# EasyEDA schematic 5G-PreCiSe-SMT100_2023-10-27.json
TITLE: SMT100-LoRa-v0.9; REV: 0.9; Date: 2023-01-26; Sheet: 1/1; Company: 5G-PreCiSe / HS Reutlingen
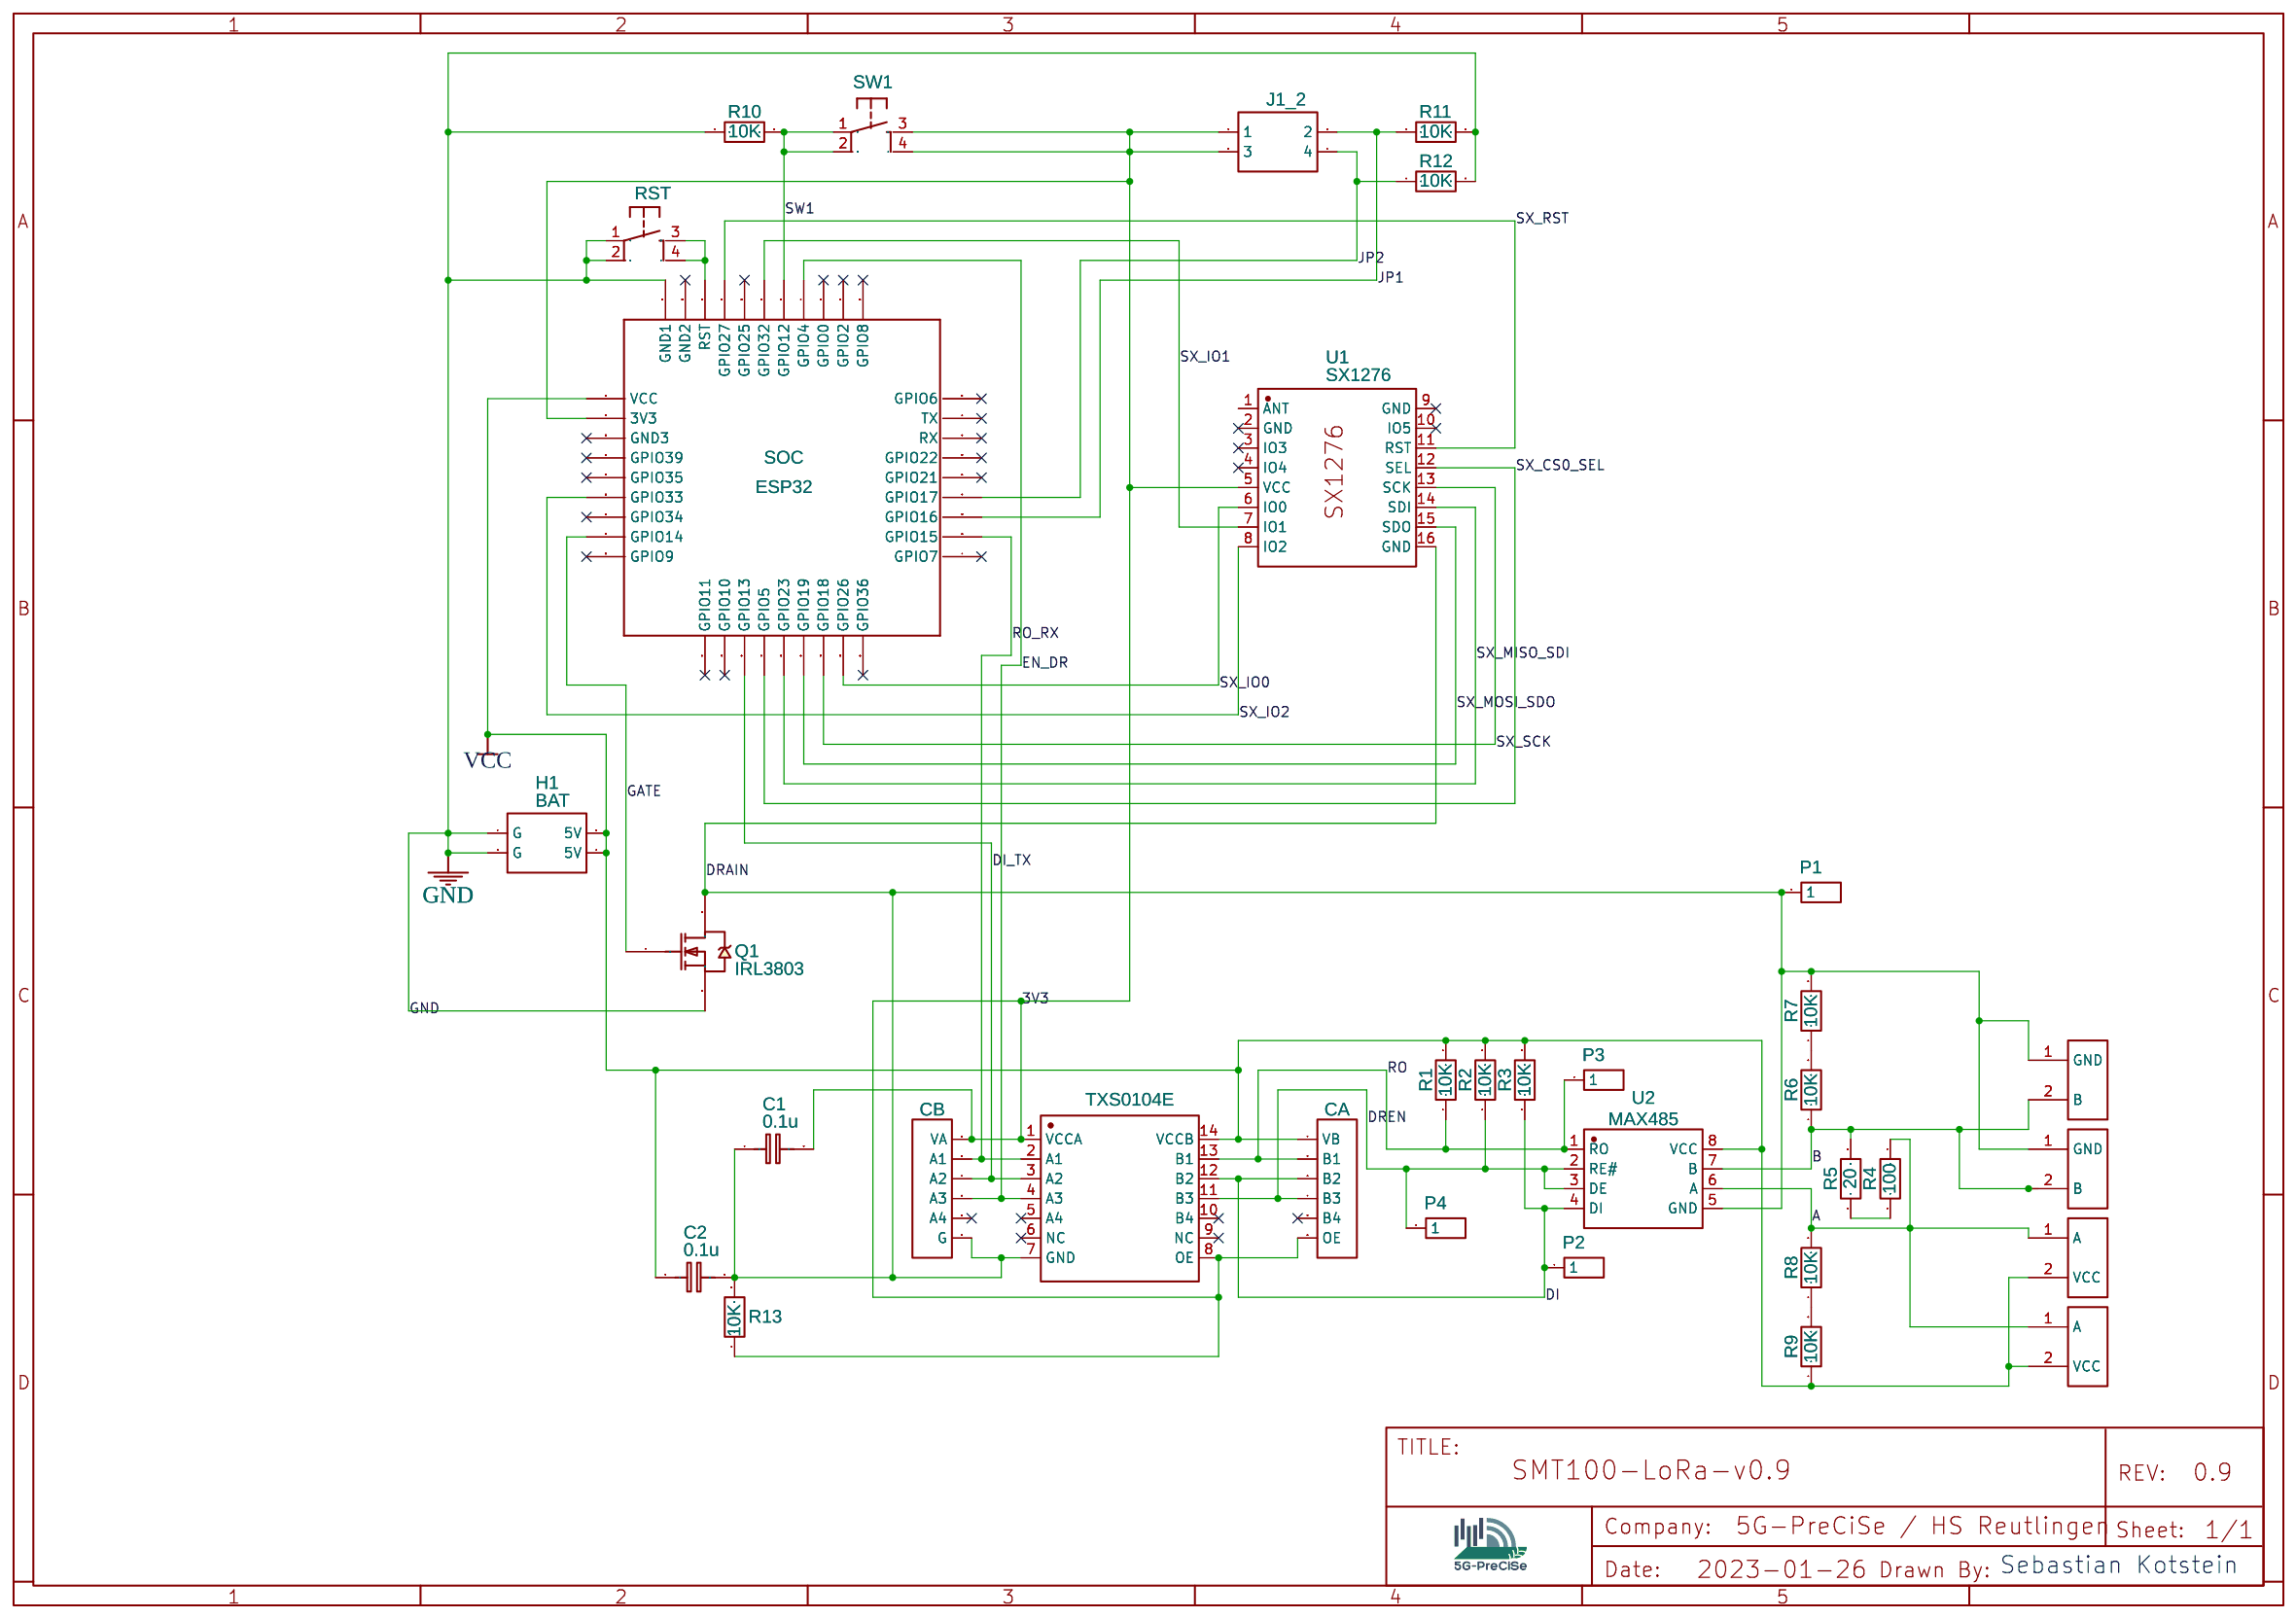
[diagram p0: schematic sheet]

## Parts
C1  0.1u  [C0603]
C2  0.1u  [C0603]
GND_B_0  TERMINAL_2P/5.08  [5.08-2P_SCREW_TERMINAL]
GND_B_1  TERMINAL_2P/5.08  [5.08-2P_SCREW_TERMINAL]
H1  BAT  [HDR-F-2.54_2X2]
H2  CA  [HDR-F-2.54_1X6]
H3  CB  [HDR-F-2.54_1X6]
H4  J1_2  [HDR-F-2.54_2X2]
J1  P1  [HDR-M-2.54_1X1]
J2  P2  [HDR-M-2.54_1X1]
J3  P3  [HDR-M-2.54_1X1]
J4  P4  [HDR-M-2.54_1X1]
Q1  IRL3803  [TO-220AB]
R1  10K  [R_AXIAL-0.3]
R2  10K  [R_AXIAL-0.3]
R3  10K  [R_AXIAL-0.3]
R4  100  [R_AXIAL-0.3]
R5  20  [R_AXIAL-0.3]
R6  10K  [R_AXIAL-0.3]
R7  10K  [R_AXIAL-0.3]
R8  10K  [R_AXIAL-0.3]
R9  10K  [R_AXIAL-0.3]
R10  10K  [R_AXIAL-0.3]
R11  10K  [R_AXIAL-0.3]
R12  10K  [R_AXIAL-0.3]
R13  10K  [R0603]
S1  RST  [TACTILE-PTH]
S2  SW1  [TACTILE-PTH]
SOC  ESP32  [ESP32-WEMOS-D1-MINI]
U1  SX1276  [SX1276_HPDTEK]
U2  MAX485  [DIP-8_L10.0-W6.5-P2.54-LS7.6-BL]
U3  TXS0104E  [SOIC-14_L8.7-W3.9-P1.27-LS6.0-BL]
VCC_A_0  TERMINAL_2P/5.08  [5.08-2P_SCREW_TERMINAL]
VCC_A_1  TERMINAL_2P/5.08  [5.08-2P_SCREW_TERMINAL]

## Library data of the parts
C1 C2 = C_0603_EU: Contributor: LCEDA_Lib
GND_B_0 GND_B_1 VCC_A_0 VCC_A_1 = TERMINAL_2P/5.08: Manufacturer Part: Screw terminal 2p; Contributor: Giuseppe Fusi
H1 H4 = HDR-F-2.54_2x2: Supplier Part: C239342; Supplier: LCSC; Contributor: LCEDA_Lib
H2 H3 = HDR-F-2.54_1x6: Supplier Part: C40877; Supplier: LCSC; Contributor: LCEDA_Lib
J1-J4 = HDR-M-2.54_1x1: Supplier Part: C81276; Supplier: LCSC; Contributor: LCEDA_Lib
Q1 = IRL3803: HEXFET Power MOSFET
R1-R12 = R_AXIAL-0.3_EU: Contributor: LCEDA_Lib
R13 = R_0603_EU: Contributor: LCEDA_Lib
S1 S2 = TAC_SWITCHPTH: Contributor: Pierre Michael
SOC = ESP32-WEMOS-D1-MINI: Contributor: nicholaswatt
U1 = SX1276_Breakout: Supplier: eBay; Contributor: micha5104
U2 = MAX485CPA+: Supplier: LCSC; Supplier Part: C77792; Manufacturer: MAXIM(美信); Contributor: LCSC; JLCPCB Part Class: Extended Part
U3 = TXS0104EDR: Supplier: LCSC; Manufacturer: TI(德州仪器); Contributor: LCSC; Supplier Part: C79342; JLCPCB Part Class: Extended Part

## Nets
3V3: C1.2 H2.6(OE) H3.6(VA) H4.1 H4.3 R13.1 S2.3 S2.4 SOC.3V3 U1.5(VCC) U3.1(VCCA) U3.8(OE)
GND: H1.1(G) H1.3(G) Q1.3(S) R10.1 R11.2 R12.2 S1.1 S1.2 SOC.GND1
VCC: C2.1 H1.2(5V) H1.4(5V) H2.1(VB) R1.2 R2.2 R3.2 R9.1 SOC.VCC U2.8(VCC) U3.14(VCCB) VCC_A_0.2(VCC) VCC_A_1.2(VCC)
A: R4.1 R8.2 U2.6(A) VCC_A_0.1(A) VCC_A_1.1(A)
B: GND_B_0.2(B) GND_B_1.2(B) R5.2 R6.1 U2.7(B)
DI: H2.3(B2) J2.1 R3.1 U2.4(DI) U3.12(B2)
DI_TX: H3.4(A2) SOC.13(GPIO13) U3.3(A2)
DRAIN: C1.1 C2.2 GND_B_0.1(GND) GND_B_1.1(GND) H3.1(G) J1.1 Q1.2(D) R7.2 R13.2 U1.16(GND) U2.5(GND) U3.7(GND)
DREN: H2.4(B3) J4.1 R2.1 U2.2(RE#) U2.3(DE) U3.11(B3)
EN_DR: H3.3(A3) SOC.4(GPIO4) U3.4(A3)
GATE: Q1.1(G) SOC.14(GPIO14)
JP1: H4.2 R11.1 SOC.16(GPIO16)
JP2: H4.4 R12.1 SOC.17(GPIO17)
RO: H2.2(B1) J3.1 R1.1 U2.1(RO) U3.13(B1)
RO_RX: H3.5(A1) SOC.15(GPIO15) U3.2(A1)
SW1: R10.2 S2.1 S2.2 SOC.12(GPIO12)
SX_CS0_SEL: SOC.5(GPIO5) U1.12(SEL)
SX_IO0: SOC.26(GPIO26) U1.6(IO0)
SX_IO1: SOC.32(GPIO32) U1.7(IO1)
SX_IO2: SOC.33(GPIO33) U1.8(IO2)
SX_MISO_SDI: SOC.23(GPIO23) U1.14(SDI)
SX_MOSI_SDO: SOC.19(GPIO19) U1.15(SDO)
SX_RST: SOC.27(GPIO27) U1.11(RST)
SX_SCK: SOC.18(GPIO18) U1.13(SCK)
Net-(R4-2): R4.2 R5.1
Net-(R6-2): R6.2 R7.1
Net-(R8-1): R8.1 R9.2
Net-(S1-3): S1.3 S1.4 SOC.RST

Not connected (* = marked no-connect by the designer): H2 5(B4)*; H3 2(A4)*; SOC 0(GPIO0)* 2(GPIO2)* 6(GPIO6)* 7(GPIO7)* 8(GPIO8)* 9(GPIO9)* 10(GPIO10)* 11(GPIO11)* 21(GPIO21)* 22(GPIO22)* 25(GPIO25)* 34(GPIO34)* 35(GPIO35)* 36(GPIO36)* 39(GPIO39)* GND2* GND3* RX* TX*; U1 1(ANT) 2(GND)* 3(IO3)* 4(IO4)* 9(GND)* 10(IO5)*; U3 5(A4)* 6(NC)* 9(NC)* 10(B4)*

## Notes on the sheet
- Sebastian Kotstein
